# Altium schematic sheet Alimentations.SchDoc
size A4
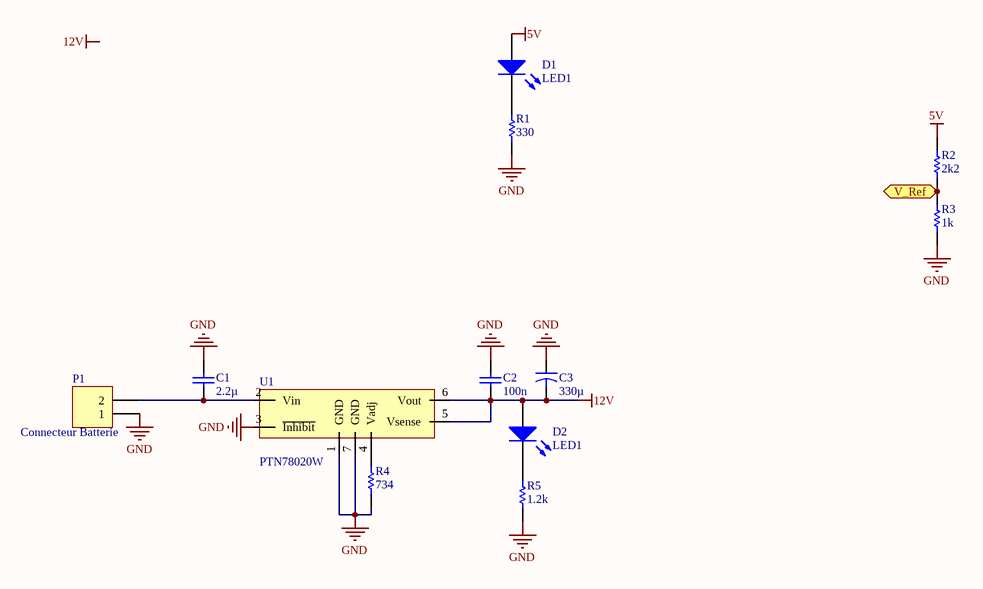
[diagram p0: Alimentations.SchDoc]

## Parts
C1  value 2.2µ  [RAD-0.3]  (hidden comment: Cap)
C2  value 100n  [RAD-0.3]  (hidden comment: Cap)
C3  value 330µ  [CAPR5-4X5]  (hidden comment: Cap2)
D1  LED1  [C0805]
D2  LED1  [C0805]
P1  Connecteur Batterie  [HDR1X2]
R1  value 330  [AXIAL-0.3]  (hidden comment: Res1)
R2  value 2k2  [AXIAL-0.3]  (hidden comment: Res1)
R3  value 1k  [AXIAL-0.3]  (hidden comment: Res1)
R4  value 734  [AXIAL-0.3]  (hidden comment: Res1)
R5  value 1.2k  [AXIAL-0.3]  (hidden comment: Res1)
U1  PTN78020W

## Ports
V_Ref

## Nets
5V: D1.1(A) R2.1
12V: C2.1 C3.2 D2.1(A) U1.5(Vsense) U1.6(Vout)
GND: C1.2 C2.2 C3.1 P1.1 R1.2 R3.2 R4.1 R5.2 U1.1(GND) U1.3(~{Inhibit}) U1.7(GND)
V_Ref: R2.2 R3.1 ; port V_Ref
NetC1_1: C1.1 P1.2 U1.2(Vin)
NetD1_2: D1.2(K) R1.1
NetD2_2: D2.2(K) R5.1
NetR4_2: R4.2 U1.4(Vadj)

## Notes on the sheet
- Labels drawn without touching a wire or pin: 12V

## Library data of the parts
C1 C2 = Cap: Capacitor; Published: 8-Jun-2000; LatestRevisionDate: 17-Jul-2002; LatestRevisionNote: Re-released for DXP Platform.; PackageReference: RAD-0.3; Publisher: Altium Limited
C3 = Cap2: Capacitor; Published: 23-Sep-2002; PackageReference: CAPR5-4X5; Publisher: Altium Limited
D1 D2 = LED1: Typical RED GaAs LED; Published: 8-Jun-2000; LatestRevisionDate: 08-Jul-2005; LatestRevisionNote: Mech Layer 1 removed.; PackageReference: LED-1; Publisher: Altium Limited
P1 = Header 2: Header, 2-Pin; LatestRevisionDate: 17-Jul-2002; LatestRevisionNote: Re-released for DXP Platform.; Publisher: Altium Limited
R1-R5 = Res1: Resistor; Published: 8-Jun-2000; LatestRevisionDate: 17-Jul-2002; LatestRevisionNote: Re-released for DXP Platform.; PackageReference: AXIAL-0.3; Publisher: Altium Limited